# Altium schematic sheet 5V SMPS 2.0.SchDoc
size A4; SheetNumber: 1; SheetTotal: 1
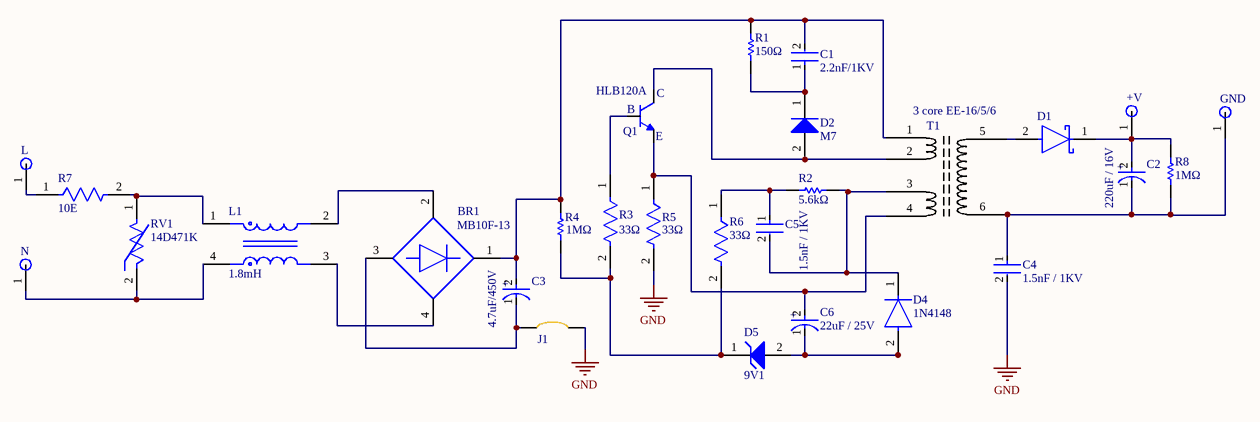
[diagram p0: 5V SMPS 2.0.SchDoc]

## Parts
+V  L  [Wire_point_0.5mm]  (value not drawn)
BR1  MB10F-13  [FP-MBF-MFG]
C1  2.2nF/1KV  [FP-DE6_D9_T7_F10_d0_6-0_0-MFG]
C2  220uF / 16V  [FP-RAD-TH-D_6_3_0_5-L_11-MFG]
C3  4.7uF/450V  [FP-RAD-TH-D_10_0_5-L_20_2-MFG]
C4  1.5nF / 1KV  [FP-DE1_D8_T4_F10_d0_6-0_0-MFG]
C5  1.5nF / 1KV  [FP-DE1_D8_T4_F10_d0_6-0_0-MFG]
C6  22uF / 25V  [FP-RAD-TH-D_5_0_5-L_7_1-F-MFG]
D1  PMEG3010BER,115  [FP-SOD123W-MFG]  (value not drawn)
D2  M7  [ONSC-SOD-323-2-477-02_V]
D4  1N4148  [FP-S8-V-3910_01-001-MFG]
D5  9V1  [ONSC-SOD-123-2-425-04_V]
GND  L  [Wire_point_0.5mm]  (value not drawn)
J1  7 mm long jumper  [J?]  (value not drawn)
L  L  [Wire_point_0.5mm]  (value not drawn)
L1  1.8mH  [FP-PLA10A_sw-MFG]
N  L  [Wire_point_0.5mm]  (value not drawn)
Q1  HLB120A  [HLB12A]
R1  150Ω  [RESC3216X60X45ML10T20]
R2  5.6kΩ  [RESC3216X60X45LL10T20]
R3  33Ω  [FP-CRCW1206-e3-IPC_B]
R4  1MΩ  [RESC3116X65X40LL10T20]
R5  33Ω  [FP-CRCW1206-e3-IPC_B]
R6  33Ω  [FP-CRCW1206-e3-IPC_B]
R7  10E  [FP-CFR50J2K2-MFG]
R8  1MΩ  [RESC2512(6432)_N]
RV1  14D471K  [FP-MOV-14D471K-MFG]
T1  3 core EE-16/5/6  [Transformer]

## Nets
GND: C4.2 J1.2 R5.2
Net+V_1: +V.1 C2.2(A) D1.1(K) R8.2
NetBR1_1: BR1.1(+) C1.2 C3.2(A) R1.2 R4.2 T1.1
NetBR1_2: BR1.2(1_~) L1.2
NetBR1_3: BR1.3(-) C3.1(C) J1.1
NetBR1_4: BR1.4(2_~) L1.3
NetC1_1: C1.1 D2.1(K) R1.1
NetC2_1: C2.1(C) C4.1 GND.1 R8.1 T1.6
NetC5_1: C5.1 R2.1 R6.1
NetC5_2: C5.2 D4.1(C) R2.2 T1.3
NetC6_1: C6.1(C) D4.2(A) D5.2(A)
NetC6_2: C6.2(A) Q1.3(E) R5.1 T1.4
NetD1_2: D1.2(A) T1.5
NetD2_2: D2.2(A) Q1.2(C) T1.2
NetD5_1: D5.1(K) R3.2 R4.1 R6.2
NetL1_1: L1.1 R7.2 RV1.1
NetL1_4: L1.4 N.1 RV1.2
NetL_1: L.1 R7.1
NetQ1_1: Q1.1(B) R3.1

## Notes on the sheet
- (in symbol CMP-05427-000685-1) +
- (in symbol CMP-05427-000868-1) +
- (in symbol CMP-05427-001207-1) +

## Library data of the parts
+V GND L N = Wire_point_0.5mm
BR1 = CMP-12791-000022-1: BRIDGE RECT 1PHASE 1KV 800MA MBF; Manufacturer: Diodes Incorporated; Max Surge Forward Current: 30A; Max Repetitive Reverse Voltage: 1000V; Peak Reverse Current: 0.2uA; Capacitance: 8pF; Value: 8pF; Max Junction Temp: +150°C; Forward Current: 0.5A; ComponentLink2Description: Datasheet; Category: Diode; RoHS: TRUE; Package: MBF; Device Class L2: Diodes; Lead Free: Yes; Manufacturer Part Number: MB10F-13; Temperature Range Low: -55°C; Footprint Url: https://www.diodes.com/assets/Package-Files/MBF.pdf; Octopart: https://octopart.com/mb10f-13-diodes+inc.-82160020; Automotive: No; Device Class L3: Rectifier Diodes; Digikey Description: BRIDGE RECT 1PHASE 1KV 800MA MBF; ComponentLink2URL: https://www.diodes.com/assets/Datasheets/MB10F.pdf; Reverse Voltage: 1000V; Temperature Range High: +150°C; Temperature: -55°C to +150°C; Mouser Description: Diode Rectifier Bridge Single 1000V 0.8A 4-Pin Case MBF T/R; Height: 1.8mm; Device Class L1: Discrete Semiconductors
C1 = CMP-00260-135708671-1: DE6E3KJ222MN4A Ceramic Suppression Capacitor, 2200 pF, ± 20%, X1 / Y2, 440 V, 300 V, Radial Leaded; Capacitance: 2.2nF; Voltage Rating: 1kV; Tolerance: 20%; Material: Ceramic; Min Operating Temperature: -40°C; Lifecycle Status: Production; NexarPartId: 135708671; Height: 12mm; Max Operating Temperature: 125°C; Case/Package: Radial
C2 = CMP-05427-000685-1: Aluminum Electrolytic Capacitors (Radial Lead Type) AEC-Q200 Qualified 220uF ±20% 16V; Ripple Current: 180mA; Lead/Base Style: Straight; Life (Hours): 1000Hour; Lead Diameter: 0.5mm; Mount: Through Hole; Lead Pitch: 5mm; Case/Package: Radial; Min Operating Temperature: -55°C; Height - Seated (Max): 0.48inch; RoHS Compliant: Yes; Radiation Hardening: No; Tolerance: 20%; Packaging: Ammo Pack; Voltage Rating: 16V; Voltage Rating (DC): 16V; Max Operating Temperature: 105°C; Series: NHG; Package Quantity: 2000; Height: 11.2mm; Termination: Radial; Length: 11.2mm; Capacitance: 220uF; Diameter: 6.3mm
C3 = CMP-05427-000868-1: ECA2WHG4R7 Aluminum Electrolytic Capacitors (Radial Lead Type) 4.7uF ±20% 450V; Dielectric Material: Aluminium; Lead/Base Style: Straight; Ripple Current: 49mA; Lead Diameter: 0.6mm; Life (Hours): 2000Hour; Leakage Current: 10uA; Dissipation Factor: 0.24%; Contact Plating: Tin; Height - Seated (Max): 0.866inch; Lead Pitch: 5mm; Min Operating Temperature: -25°C; Length: 20mm; REACH SVHC: No SVHC; Series: NHG; Number of Pins: 2; Voltage Rating (DC): 450V; Mount: Through Hole; Capacitance: 4.7uF; Package Quantity: 200; Voltage Rating: 450V; Termination: Radial; Max Operating Temperature: 105°C; Ripple Current (AC): 49mA; Packaging: Bulk; Radiation Hardening: No; Voltage: 450V; Height: 20mm; Lead Free: Lead Free; Tolerance: 20%; Case/Package: Radial; Diameter: 10mm; Construction: RADIAL; RoHS Compliant: Yes
C4 C5 = CMP-06035-063098-1: Safety Standard Certified Lead Type Disc Ceramic Capacitors for General Purpose, 1500pF ±20%, E(JIS), 400Vac(r.m.s.), +20/-55%, Radial
C6 = CMP-05427-001207-1: Aluminum Electrolytic Capacitors (Radial Lead Type) 22uF ±20% 25V; Ripple Current: 55mA; Life (Hours): 1000Hour; Length: 7mm; Series: KA; RoHS Compliant: Yes; Lead Pitch: 2.5mm; Capacitance: 22uF; Height: 7mm; Packaging: Ammo Pack; Package Quantity: 2000; Radiation Hardening: No; Diameter: 5mm; Min Operating Temperature: -40°C; Termination: Radial; Height - Seated (Max): 0.315inch; Max Operating Temperature: 85°C; Mount: Through Hole; Case/Package: Radial; Tolerance: 20%; Voltage Rating (DC): 25V; Voltage Rating: 25V
D1 = CMP-14398-000004-1: DIODE SCHOTTKY 30V 1A SOD123W; Manufacturer: Nexperia; Automotive Grade: Grade 0; Max Surge Forward Current: 50A; Peak Reverse Current: 15uA; Max Junction Temp: +150°C; Capacitance: 170pF; Value: 170pF; ComponentLink2URL: https://assets.nexperia.com/documents/data-sheet/PMEG3010BER.pdf; Reverse Voltage: 30V; Forward Current: 1A; Ambient Temperature Range Low: -55°C; Ambient Temperature Range High: +150°C; Octopart: https://octopart.com/pmeg3010ber%2C115-nexperia-78741454; Package: SOD123W; Category: Diode; Lead Free: Yes; Digikey Description: DIODE SCHOTTKY 30V 1A SOD123W; Automotive: Yes; RoHS: TRUE; Height: 1.1mm; Temperature: to +150°C; Device Class L2: Diodes; ComponentLink2Description: Datasheet; Manufacturer Part Number: PMEG3010BER,115; Temperature Range High: +150°C; Device Class L3: Schottky Diodes; Device Class L1: Discrete Semiconductors; Footprint Url: https://assets.nexperia.com/documents/outline-drawing/SOD123W.pdf
D2 = CMP-1054-00003-1: 1A Vf1000V  Diode SOD-323, Pb-Free, Tape and Reel; PartNumber: MMDL914T3G; Manufacturer: On Semiconductor; Configuration: Single; IF Max (A): 0.2; trr Max (ns): 4; ComponentLink2URL: http://www.onsemi.com/pub_link/Collateral/MMDL914T1-D.PDF; PackageReference: SOD-323-2-477-02; RoHS: TRUE; Packing: Tape and Reel; ComponentLink1Description: Manufacturer URL; ComponentLink2Description: Datasheet; Mounting Technology: Surface Mount; ComponentLink1URL: http://www.onsemi.com/; PackageDescription: 2-Pin SOD, Body 1.7 x 1.25 mm; ComponentLink3Description: Package Specification; ComponentLink3URL: http://www.onsemi.com/pub_link/Collateral/477-02.PDF.1; DatasheetVersion: Rev. 9; PackageVersion: Rev. H, 03/2007
D4 = CMP-00030-46456310-1: 1N4148W-G3-08 Rectifier Diode, 1 Phase, 1 Element, 0.15A, 100V V(RRM), Silicon; Forward Current: 150mA; Reverse Recovery Time: 4ns; Peak Non-Repetitive Surge Current: 500mA; Element Configuration: Single; Forward Voltage: 1.2V; Max Reverse Voltage (DC): 75V; Schedule B: 8541100070, 8541100070; Max Repetitive Reverse Voltage (Vrrm): 100V; Weight: 9.412042mg; NexarPartId: 46456310; Contact Plating: Tin; Max Operating Temperature: 150°C; Case/Package: SOD; Mount: Surface Mount; RoHS: Compliant; Min Operating Temperature: -55°C; Average Rectified Current: 150mA; Number of Pins: 2
D5 = CMP-1060-00344-1: SZMMSZ9V1T1G Zener Voltage Regulator, 500 mW, 2-Pin SOD-123, Pb-Free, Tape and Reel; Manufacturer: On Semiconductor; P Max (W): 0.5; RoHS: Pb-Free; DatasheetVersion: Rev. 11; PartNumber: SZMMSZ9V1T1G; ComponentLink2URL: http://www.onsemi.com/pub_link/Collateral/MMSZ2V4T1-D.PDF; ComponentLink2Description: Datasheet; Mounting Technology: Surface Mount; Packing: Tape and Reel; ComponentLink3URL: http://www.onsemi.com/pub_link/Collateral/425-04.PDF; ComponentLink1Description: Manufacturer URL; PackageDescription: 2-Pin SOD, Body 1.6 x 2.69 mm; ComponentLink3Description: Package Specification; ComponentLink1URL: http://www.onsemi.com/; PackageVersion: Rev. G, 10/2009; PackageReference: SOD-123-2-425-04
L1 = CMP-06045-000735-1: Common Mode Choke Dual 1.8mH 1.5A 0.21Ω DCR Thru-Hole Bulk; DC Resistance (DCR): 100mR; Body Diameter: 1.2mm; Voltage Rating (AC): 300V; Lead/Base Style: Pin; Number of Lines: 2; Shielding: Unshielded; Depth: 16mm; REACH SVHC: No SVHC; Height: 17.5mm; Series: EMIFIL®, PLA10; Packaging: Bulk; Max DC Current: 1.5A; Package Quantity: 1260; RoHS Compliant: Yes; Number of Pins: 4; Current: 1.5A; Inductance: 1.8mH; Voltage Rating: 300V; Insulation Resistance: 100MR; Length: 18mm; Termination: Radial; Mount: Through Hole; Radiation Hardening: No; Min Operating Temperature: -25°C; Voltage Rating (DC): 300V; Max Operating Temperature: 120°C; Width: 16mm; DC Current: 1.5A; Military Standard: Not; RMS Current (Irms): 1.5A
Q1 = HLB120A: Transistor General Purpose BJT NPN 40 Volt 0.2 Amp 3-Pin TO-92 Tape And Reel; MF: Fairchild Semiconductor; MP: 2N3904TF; SnapEDA_Link: https://www.snapeda.com/parts/2N3904TF/Fairchild+Imaging/view-part/?ref=snap; Package: TO-92-3 ON Semiconductor; Value: *; Check_prices: https://www.snapeda.com/parts/2N3904TF/Fairchild+Imaging/view-part/?ref=eda
R1 = CMP-2003-01811-1: CRCW1206150KJNEA; Manufacturer: Vishay Dale; Part Number: CRCW1206150KJNEA
R2 = CMP-2003-02302-1: Manufacturer: Vishay Dale; Part Number: CRCW12065K60FKEA
R3 R5 R6 = CMP-02407-001891-1: CRCW120633R0FKEA RES Thick Film, 33Ω, 1%, 0.25W, 100ppm/°C, 1206; Voltage Rating (DC): 200V; Power Rating: 250mW; Resistance: 33R; Features: Automotive AEC-Q200; Case Code (Imperial): 1206; Packaging: Tape and Reel; Package Quantity: 10; Composition: Thick Film; Height: 0.55mm; Depth: 1.6mm; Radiation Hardening: No; Lead Free: Lead Free; Width: 1.6mm; Weight: 0.000353oz; Case Code (Metric): 3216; Max Power Dissipation: 250mW; Voltage Rating: 200V; Termination: SMD/SMT; Tolerance: 1%; Min Operating Temperature: -55°C; Case/Package: 1206; Contact Plating: Tin; Max Operating Temperature: 155°C; Temperature Coefficient: 100ppm/°C; Military Standard: Not; Number of Terminations: 2; Length: 3.2mm
R4 = CMP-2003-04325-1: RV1206FR-071ML; Manufacturer: Yageo; Part Number: RV1206FR-071ML
R7 = CMP-03212-000011-1: RES 10 OHM 5% 1/2W AXIAL; Temperature Coefficient: 0ppm/°C; Max Power Dissipation: 500mW; Resistance: 2.2kR; Number of Resistors: 1; Voltage Rating (DC): 350V; Case/Package: Axial; Number of Terminations: 2; REACH SVHC: No SVHC; Mount: Axial; Packaging: Cut Tape; Min Operating Temperature: -55°C; Series: CFR50, Neohm; Resistor Type: Thin Film; Tolerance: 5%; Radiation Hardening: No; Package Quantity: 3000; Power Rating: 500mW; Length: 9mm; Termination: Axial; Max Operating Temperature: 155°C; ELV: Compliant; Voltage Rating: 350V; Resistance Tolerance: 5%; Technology: CARBON FILM; Diameter: 3mm; RoHS Compliant: Yes
R8 = CMP-1018-00146-1: 1M 1W 5% 2512 (6432 Metric)  SMD; Case-EIA: 2512; Value: 1000000.00 Ohm; Case-Metric: 6432; Power: 1 W; Tolerance: 5 %; Technology: SMT
RV1 = CMP-07402-000007-1: MOV-14D471K VARISTOR 470V 4.5KA DISC 14MM; Manufacturer: Bourns Inc.; Value: 516pF; Clamping Voltage: 775V; Esd Protec Present: true; Voltage Rating Ac: 300V; Clamping Current: 50A; Voltage Tolerance: 10%; Varistor Voltage: 423V; Voltage Rating Dc: 385V; Temperature Range High: +105°C; Device Class L3: unset; Category: Res; Package: Radial; Height: 20mm; Device Class L1: Circuit Protection; Temperature Range Low: -40°C; Lead Free: Yes; Automotive: No; Mouser Description: Varistors 470volts 14mm; RoHS: TRUE; Octopart: https://octopart.com/mov-14d471k-bourns-21388916; Device Class L2: Varistors; Manufacturer Part Number: MOV-14D471K; Digikey Description: VARISTOR 470V 4.5KA DISC 14MM; Temperature: -40°C to +105°C; Capacitance: 516pF; ComponentLink2Description: Datasheet; ComponentLink2URL: https://www.bourns.com/docs/product-datasheets/mov14d.pdf?sfvrsn=d6ed188_26
T1 = Transformer: Ferrite Core Transformer 3 core EE-16/5/6 500mA output 5V